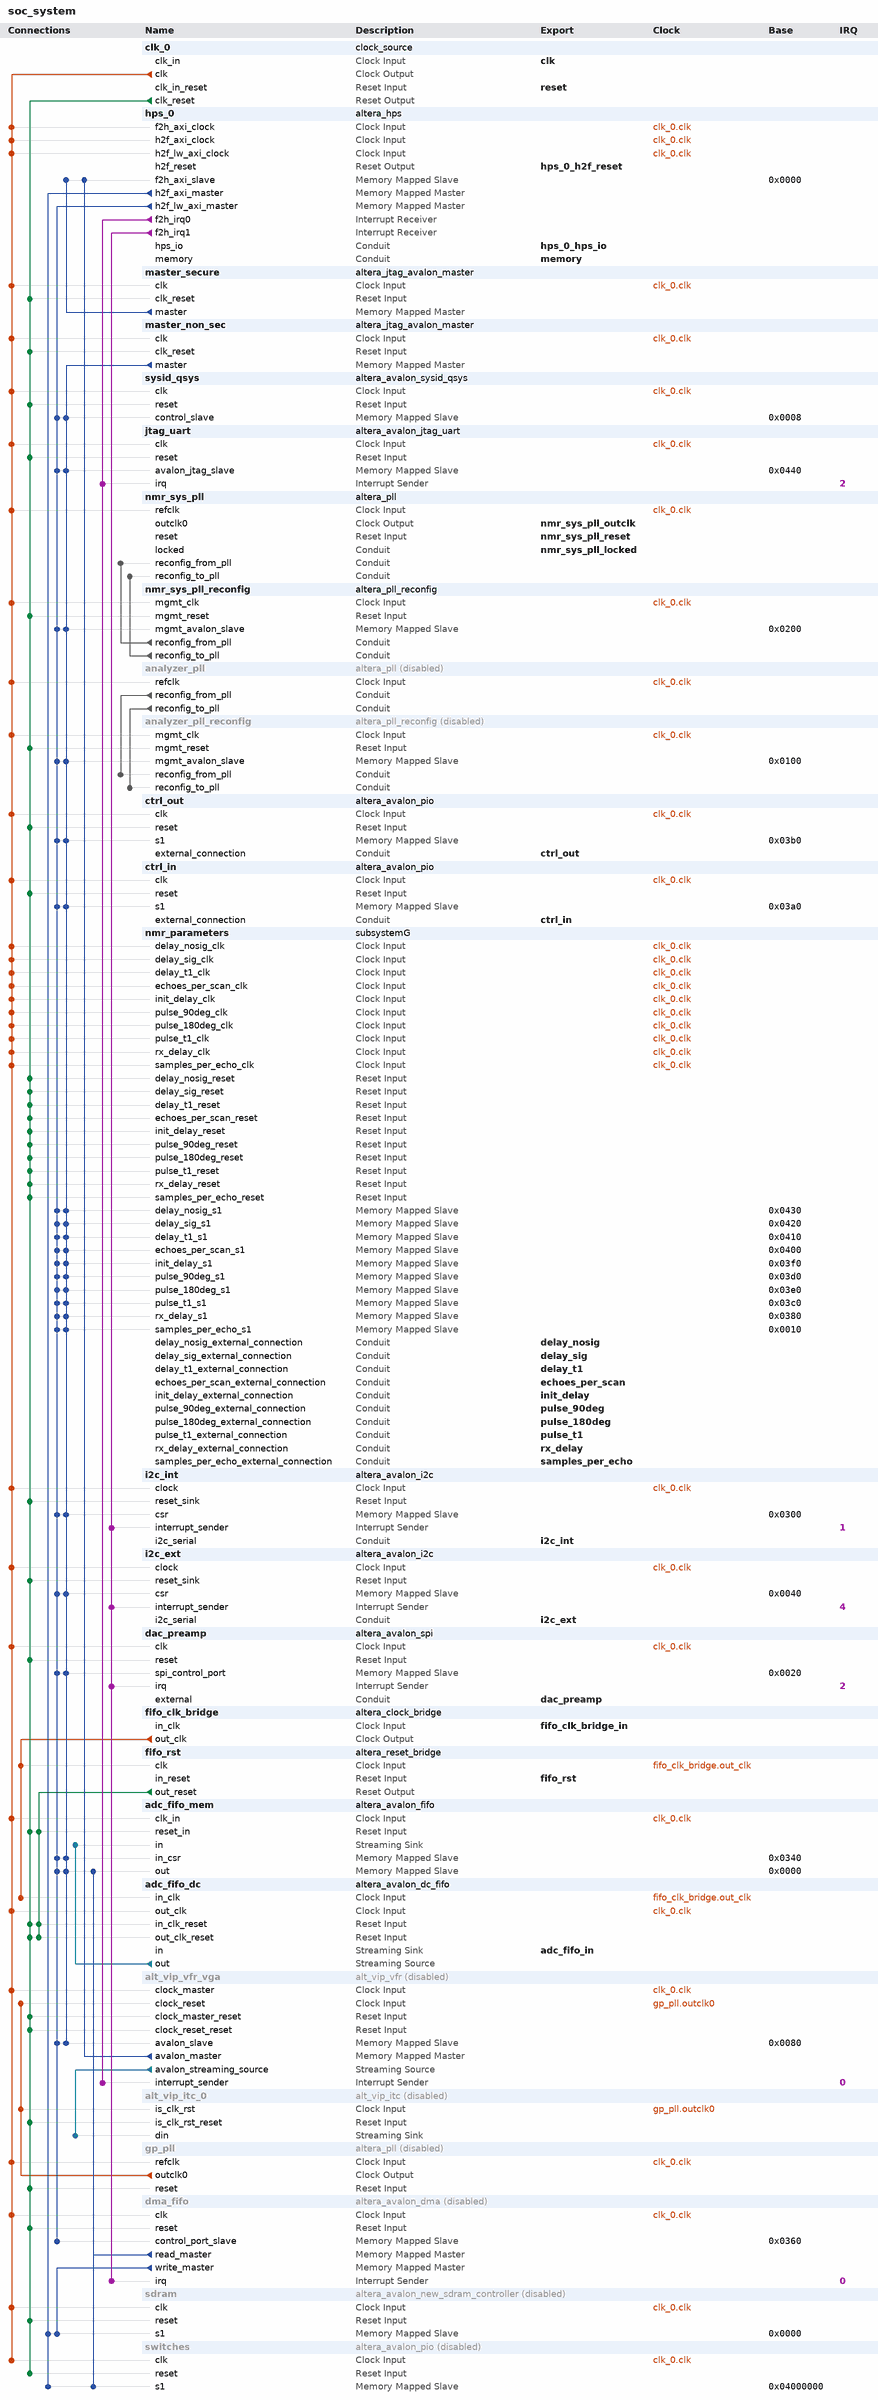
[diagram p0: system contents]
# Platform Designer (Qsys) system soc_system, Cyclone V 5CSEMA4U23C6
# Parameters at their usual value, and those the tool derives, are not listed.
package require -exact qsys 17.1
create_system soc_system
set_project_property DEVICE_FAMILY {Cyclone V}
set_project_property DEVICE 5CSEMA4U23C6

add_instance clk_0 clock_source 17.1
set_instance_parameter_value clk_0 clockFrequency 50000000

add_instance hps_0 altera_hps 17.1
set_instance_parameter_value hps_0 EMAC1_Mode RGMII
set_instance_parameter_value hps_0 EMAC1_PinMuxing {HPS I/O Set 0}
set_instance_parameter_value hps_0 F2SCLK_COLDRST_Enable false
set_instance_parameter_value hps_0 F2SCLK_DBGRST_Enable false
set_instance_parameter_value hps_0 F2SCLK_WARMRST_Enable false
set_instance_parameter_value hps_0 F2SINTERRUPT_Enable true
set_instance_parameter_value hps_0 F2S_Width 2
set_instance_parameter_value hps_0 FPGA_PERIPHERAL_OUTPUT_CLOCK_FREQ_EMAC0_GTX_CLK 100
set_instance_parameter_value hps_0 FPGA_PERIPHERAL_OUTPUT_CLOCK_FREQ_EMAC0_MD_CLK 100.0
set_instance_parameter_value hps_0 FPGA_PERIPHERAL_OUTPUT_CLOCK_FREQ_EMAC1_GTX_CLK 100
set_instance_parameter_value hps_0 FPGA_PERIPHERAL_OUTPUT_CLOCK_FREQ_EMAC1_MD_CLK 100.0
set_instance_parameter_value hps_0 HPS_PROTOCOL DDR3
set_instance_parameter_value hps_0 I2C0_Mode I2C
set_instance_parameter_value hps_0 I2C0_PinMuxing {HPS I/O Set 0}
set_instance_parameter_value hps_0 I2C1_Mode I2C
set_instance_parameter_value hps_0 I2C1_PinMuxing {HPS I/O Set 0}
set_instance_parameter_value hps_0 LWH2F_Enable true
set_instance_parameter_value hps_0 MEM_BANKADDR_WIDTH 3
set_instance_parameter_value hps_0 MEM_CLK_FREQ 400.0
set_instance_parameter_value hps_0 MEM_COL_ADDR_WIDTH 10
set_instance_parameter_value hps_0 MEM_DQ_WIDTH 32
set_instance_parameter_value hps_0 MEM_DRV_STR RZQ/6
set_instance_parameter_value hps_0 MEM_ROW_ADDR_WIDTH 15
set_instance_parameter_value hps_0 MEM_RTT_NOM RZQ/6
set_instance_parameter_value hps_0 MEM_RTT_WR {Dynamic ODT off}
set_instance_parameter_value hps_0 MEM_TCL 7
set_instance_parameter_value hps_0 MEM_TFAW_NS 37.5
set_instance_parameter_value hps_0 MEM_TRAS_NS 35.0
set_instance_parameter_value hps_0 MEM_TRCD_NS 13.75
set_instance_parameter_value hps_0 MEM_TRFC_NS 300.0
set_instance_parameter_value hps_0 MEM_TRP_NS 13.75
set_instance_parameter_value hps_0 MEM_VENDOR Other
set_instance_parameter_value hps_0 MEM_WTCL 7
set_instance_parameter_value hps_0 QSPI_Mode N/A
set_instance_parameter_value hps_0 QSPI_PinMuxing Unused
set_instance_parameter_value hps_0 REF_CLK_FREQ 25.0
set_instance_parameter_value hps_0 S2FCLK_USER2CLK 5
set_instance_parameter_value hps_0 S2F_Width 1
set_instance_parameter_value hps_0 SDIO_Mode {4-bit Data}
set_instance_parameter_value hps_0 SDIO_PinMuxing {HPS I/O Set 0}
set_instance_parameter_value hps_0 SPIM1_Mode {Single Slave Select}
set_instance_parameter_value hps_0 SPIM1_PinMuxing {HPS I/O Set 0}
set_instance_parameter_value hps_0 STM_Enable true
set_instance_parameter_value hps_0 TIMING_BOARD_AC_SKEW 0.02
set_instance_parameter_value hps_0 TIMING_BOARD_AC_TO_CK_SKEW 0.0
set_instance_parameter_value hps_0 TIMING_BOARD_DQ_TO_DQS_SKEW 0.0
set_instance_parameter_value hps_0 TIMING_BOARD_MAX_CK_DELAY 0.06
set_instance_parameter_value hps_0 TIMING_BOARD_MAX_DQS_DELAY 0.06
set_instance_parameter_value hps_0 TIMING_BOARD_SKEW_BETWEEN_DQS 0.02
set_instance_parameter_value hps_0 TIMING_BOARD_SKEW_CKDQS_DIMM_MAX 0.01
set_instance_parameter_value hps_0 TIMING_BOARD_SKEW_CKDQS_DIMM_MIN -0.01
set_instance_parameter_value hps_0 TIMING_BOARD_SKEW_WITHIN_DQS 0.02
set_instance_parameter_value hps_0 TIMING_TDH 125
set_instance_parameter_value hps_0 TIMING_TDQSCK 400
set_instance_parameter_value hps_0 TIMING_TDQSQ 120
set_instance_parameter_value hps_0 TIMING_TDS 50
set_instance_parameter_value hps_0 TIMING_TIH 250
set_instance_parameter_value hps_0 TIMING_TIS 175
set_instance_parameter_value hps_0 TIMING_TQSH 0.38
set_instance_parameter_value hps_0 UART0_Mode {No Flow Control}
set_instance_parameter_value hps_0 UART0_PinMuxing {HPS I/O Set 0}
set_instance_parameter_value hps_0 USB1_Mode SDR
set_instance_parameter_value hps_0 USB1_PinMuxing {HPS I/O Set 0}
set_instance_parameter_value hps_0 desired_cfg_clk_mhz 97.368421
set_instance_parameter_value hps_0 desired_qspi_clk_mhz 370.0

add_instance master_secure altera_jtag_avalon_master 17.1

add_instance master_non_sec altera_jtag_avalon_master 17.1

add_instance sysid_qsys altera_avalon_sysid_qsys 17.1
set_instance_parameter_value sysid_qsys id -1395322110

add_instance jtag_uart altera_avalon_jtag_uart 17.1
set_instance_parameter_value jtag_uart allowMultipleConnections true
set_instance_parameter_value jtag_uart simInteractiveOptions INTERACTIVE_ASCII_OUTPUT

add_instance nmr_sys_pll altera_pll 17.1
set_instance_parameter_value nmr_sys_pll gui_device_speed_grade 1
set_instance_parameter_value nmr_sys_pll gui_en_reconf true
set_instance_parameter_value nmr_sys_pll gui_number_of_clocks 1
set_instance_parameter_value nmr_sys_pll gui_operation_mode direct
set_instance_parameter_value nmr_sys_pll gui_output_clock_frequency0 120.0
set_instance_parameter_value nmr_sys_pll gui_pll_mode {Fractional-N PLL}
set_instance_parameter_value nmr_sys_pll gui_reference_clock_frequency 50.0
set_instance_parameter_value nmr_sys_pll gui_use_locked true

add_instance nmr_sys_pll_reconfig altera_pll_reconfig 17.1

add_instance analyzer_pll altera_pll 17.1
set_instance_property analyzer_pll ENABLED false
set_instance_parameter_value analyzer_pll gui_device_speed_grade 1
set_instance_parameter_value analyzer_pll gui_en_reconf true
set_instance_parameter_value analyzer_pll gui_number_of_clocks 4
set_instance_parameter_value analyzer_pll gui_operation_mode direct
set_instance_parameter_value analyzer_pll gui_output_clock_frequency0 4.3
set_instance_parameter_value analyzer_pll gui_output_clock_frequency1 4.3
set_instance_parameter_value analyzer_pll gui_output_clock_frequency2 4.3
set_instance_parameter_value analyzer_pll gui_output_clock_frequency3 4.3
set_instance_parameter_value analyzer_pll gui_pll_mode {Fractional-N PLL}
set_instance_parameter_value analyzer_pll gui_reference_clock_frequency 50.0
set_instance_parameter_value analyzer_pll gui_use_locked true

add_instance analyzer_pll_reconfig altera_pll_reconfig 17.1
set_instance_property analyzer_pll_reconfig ENABLED false

add_instance ctrl_out altera_avalon_pio 17.1
set_instance_parameter_value ctrl_out direction Output
set_instance_parameter_value ctrl_out resetValue 119
set_instance_parameter_value ctrl_out width 32

add_instance ctrl_in altera_avalon_pio 17.1
set_instance_parameter_value ctrl_in direction Input
set_instance_parameter_value ctrl_in width 8

add_instance nmr_parameters subsystemG 1.0

add_instance i2c_int altera_avalon_i2c 17.1
set_instance_parameter_value i2c_int FIFO_DEPTH 32

add_instance i2c_ext altera_avalon_i2c 17.1
set_instance_parameter_value i2c_ext FIFO_DEPTH 32

add_instance dac_preamp altera_avalon_spi 17.1
set_instance_parameter_value dac_preamp clockPolarity 1
set_instance_parameter_value dac_preamp dataWidth 24
set_instance_parameter_value dac_preamp masterSPI true
set_instance_parameter_value dac_preamp numberOfSlaves 1
set_instance_parameter_value dac_preamp targetClockRate 128000

add_instance fifo_clk_bridge altera_clock_bridge 17.1
set_instance_parameter_value fifo_clk_bridge DERIVED_CLOCK_RATE 0
set_instance_parameter_value fifo_clk_bridge EXPLICIT_CLOCK_RATE 0

add_instance fifo_rst altera_reset_bridge 17.1
set_instance_parameter_value fifo_rst ACTIVE_LOW_RESET 0
set_instance_parameter_value fifo_rst SYNCHRONOUS_EDGES deassert

add_instance adc_fifo_mem altera_avalon_fifo 17.1
set_instance_parameter_value adc_fifo_mem bitsPerSymbol 16
set_instance_parameter_value adc_fifo_mem channelWidth 0
set_instance_parameter_value adc_fifo_mem errorWidth 0
set_instance_parameter_value adc_fifo_mem fifoDepth 1024
set_instance_parameter_value adc_fifo_mem fifoInputInterfaceOptions AVALONST_SINK
set_instance_parameter_value adc_fifo_mem fifoOutputInterfaceOptions AVALONMM_READ
set_instance_parameter_value adc_fifo_mem singleClockMode true
set_instance_parameter_value adc_fifo_mem symbolsPerBeat 2
set_instance_parameter_value adc_fifo_mem useIRQ false
set_instance_parameter_value adc_fifo_mem usePacket false
set_instance_parameter_value adc_fifo_mem useReadControl false

add_instance adc_fifo_dc altera_avalon_dc_fifo 17.1
set_instance_parameter_value adc_fifo_dc BITS_PER_SYMBOL 16
set_instance_parameter_value adc_fifo_dc FIFO_DEPTH 65536
set_instance_parameter_value adc_fifo_dc USE_PACKETS 0

add_instance alt_vip_vfr_vga alt_vip_vfr 14.0
set_instance_property alt_vip_vfr_vga ENABLED false
set_instance_parameter_value alt_vip_vfr_vga MAX_IMAGE_WIDTH 1024

add_instance alt_vip_itc_0 alt_vip_itc 14.0
set_instance_property alt_vip_itc_0 ENABLED false
set_instance_parameter_value alt_vip_itc_0 FIFO_DEPTH 1920
set_instance_parameter_value alt_vip_itc_0 H_ACTIVE_PIXELS 1024
set_instance_parameter_value alt_vip_itc_0 H_BACK_PORCH 160
set_instance_parameter_value alt_vip_itc_0 H_FRONT_PORCH 24
set_instance_parameter_value alt_vip_itc_0 H_SYNC_LENGTH 136
set_instance_parameter_value alt_vip_itc_0 NUMBER_OF_COLOUR_PLANES 4
set_instance_parameter_value alt_vip_itc_0 THRESHOLD 1919
set_instance_parameter_value alt_vip_itc_0 V_ACTIVE_LINES 768
set_instance_parameter_value alt_vip_itc_0 V_BACK_PORCH 29
set_instance_parameter_value alt_vip_itc_0 V_FRONT_PORCH 3
set_instance_parameter_value alt_vip_itc_0 V_SYNC_LENGTH 6

add_instance gp_pll altera_pll 17.1
set_instance_property gp_pll ENABLED false
set_instance_parameter_value gp_pll gui_device_speed_grade 2
set_instance_parameter_value gp_pll gui_number_of_clocks 4
set_instance_parameter_value gp_pll gui_operation_mode normal
set_instance_parameter_value gp_pll gui_output_clock_frequency0 130.0
set_instance_parameter_value gp_pll gui_output_clock_frequency1 65.0
set_instance_parameter_value gp_pll gui_output_clock_frequency2 50.0
set_instance_parameter_value gp_pll gui_output_clock_frequency3 50.0
set_instance_parameter_value gp_pll gui_phase_shift3 -3800
set_instance_parameter_value gp_pll gui_pll_mode {Integer-N PLL}
set_instance_parameter_value gp_pll gui_reference_clock_frequency 50.0
set_instance_parameter_value gp_pll gui_use_locked true

add_instance dma_fifo altera_avalon_dma 17.1
set_instance_property dma_fifo ENABLED false
set_instance_parameter_value dma_fifo allowByteTransactions true
set_instance_parameter_value dma_fifo allowDoubleWordTransactions true
set_instance_parameter_value dma_fifo allowHalfWordTransactions true
set_instance_parameter_value dma_fifo allowQuadWordTransactions true
set_instance_parameter_value dma_fifo burstEnable false
set_instance_parameter_value dma_fifo fifoDepth 128
set_instance_parameter_value dma_fifo maxBurstSize 4
set_instance_parameter_value dma_fifo minimumDmaTransactionRegisterWidth 32

add_instance sdram altera_avalon_new_sdram_controller 17.1
set_instance_property sdram ENABLED false
set_instance_parameter_value sdram TAC 5.4
set_instance_parameter_value sdram TRCD 15.0
set_instance_parameter_value sdram TRP 15.0
set_instance_parameter_value sdram casLatency 3
set_instance_parameter_value sdram columnWidth 10
set_instance_parameter_value sdram dataWidth 16
set_instance_parameter_value sdram generateSimulationModel true
set_instance_parameter_value sdram model single_Micron_MT48LC4M32B2_7_chip
set_instance_parameter_value sdram numberOfBanks 4
set_instance_parameter_value sdram numberOfChipSelects 1
set_instance_parameter_value sdram powerUpDelay 100.0
set_instance_parameter_value sdram refreshPeriod 7.8125
set_instance_parameter_value sdram rowWidth 13

add_instance switches altera_avalon_pio 17.1
set_instance_property switches ENABLED false
set_instance_parameter_value switches direction Input
set_instance_parameter_value switches simDoTestBenchWiring true
set_instance_parameter_value switches width 10

# connections
add_connection clk_0.clk adc_fifo_dc.out_clk clock
add_connection clk_0.clk adc_fifo_mem.clk_in clock
add_connection clk_0.clk alt_vip_vfr_vga.clock_master clock
add_connection clk_0.clk analyzer_pll.refclk clock
add_connection clk_0.clk analyzer_pll_reconfig.mgmt_clk clock
add_connection clk_0.clk ctrl_in.clk clock
add_connection clk_0.clk ctrl_out.clk clock
add_connection clk_0.clk dac_preamp.clk clock
add_connection clk_0.clk dma_fifo.clk clock
add_connection clk_0.clk gp_pll.refclk clock
add_connection clk_0.clk hps_0.f2h_axi_clock clock
add_connection clk_0.clk hps_0.h2f_axi_clock clock
add_connection clk_0.clk hps_0.h2f_lw_axi_clock clock
add_connection clk_0.clk i2c_ext.clock clock
add_connection clk_0.clk i2c_int.clock clock
add_connection clk_0.clk jtag_uart.clk clock
add_connection clk_0.clk master_non_sec.clk clock
add_connection clk_0.clk master_secure.clk clock
add_connection clk_0.clk nmr_parameters.delay_nosig_clk clock
add_connection clk_0.clk nmr_parameters.delay_sig_clk clock
add_connection clk_0.clk nmr_parameters.delay_t1_clk clock
add_connection clk_0.clk nmr_parameters.echoes_per_scan_clk clock
add_connection clk_0.clk nmr_parameters.init_delay_clk clock
add_connection clk_0.clk nmr_parameters.pulse_90deg_clk clock
add_connection clk_0.clk nmr_parameters.pulse_180deg_clk clock
add_connection clk_0.clk nmr_parameters.pulse_t1_clk clock
add_connection clk_0.clk nmr_parameters.rx_delay_clk clock
add_connection clk_0.clk nmr_parameters.samples_per_echo_clk clock
add_connection clk_0.clk nmr_sys_pll.refclk clock
add_connection clk_0.clk nmr_sys_pll_reconfig.mgmt_clk clock
add_connection clk_0.clk sdram.clk clock
add_connection clk_0.clk switches.clk clock
add_connection clk_0.clk sysid_qsys.clk clock
add_connection fifo_clk_bridge.out_clk adc_fifo_dc.in_clk clock
add_connection fifo_clk_bridge.out_clk fifo_rst.clk clock
add_connection gp_pll.outclk0 alt_vip_itc_0.is_clk_rst clock
add_connection gp_pll.outclk0 alt_vip_vfr_vga.clock_reset clock
add_connection clk_0.clk_reset adc_fifo_dc.in_clk_reset reset
add_connection clk_0.clk_reset adc_fifo_dc.out_clk_reset reset
add_connection clk_0.clk_reset adc_fifo_mem.reset_in reset
add_connection clk_0.clk_reset alt_vip_itc_0.is_clk_rst_reset reset
add_connection clk_0.clk_reset alt_vip_vfr_vga.clock_master_reset reset
add_connection clk_0.clk_reset alt_vip_vfr_vga.clock_reset_reset reset
add_connection clk_0.clk_reset analyzer_pll_reconfig.mgmt_reset reset
add_connection clk_0.clk_reset ctrl_in.reset reset
add_connection clk_0.clk_reset ctrl_out.reset reset
add_connection clk_0.clk_reset dac_preamp.reset reset
add_connection clk_0.clk_reset dma_fifo.reset reset
add_connection clk_0.clk_reset gp_pll.reset reset
add_connection clk_0.clk_reset i2c_ext.reset_sink reset
add_connection clk_0.clk_reset i2c_int.reset_sink reset
add_connection clk_0.clk_reset jtag_uart.reset reset
add_connection clk_0.clk_reset master_non_sec.clk_reset reset
add_connection clk_0.clk_reset master_secure.clk_reset reset
add_connection clk_0.clk_reset nmr_parameters.delay_nosig_reset reset
add_connection clk_0.clk_reset nmr_parameters.delay_sig_reset reset
add_connection clk_0.clk_reset nmr_parameters.delay_t1_reset reset
add_connection clk_0.clk_reset nmr_parameters.echoes_per_scan_reset reset
add_connection clk_0.clk_reset nmr_parameters.init_delay_reset reset
add_connection clk_0.clk_reset nmr_parameters.pulse_90deg_reset reset
add_connection clk_0.clk_reset nmr_parameters.pulse_180deg_reset reset
add_connection clk_0.clk_reset nmr_parameters.pulse_t1_reset reset
add_connection clk_0.clk_reset nmr_parameters.rx_delay_reset reset
add_connection clk_0.clk_reset nmr_parameters.samples_per_echo_reset reset
add_connection clk_0.clk_reset nmr_sys_pll_reconfig.mgmt_reset reset
add_connection clk_0.clk_reset sdram.reset reset
add_connection clk_0.clk_reset switches.reset reset
add_connection clk_0.clk_reset sysid_qsys.reset reset
add_connection fifo_rst.out_reset adc_fifo_dc.in_clk_reset reset
add_connection fifo_rst.out_reset adc_fifo_dc.out_clk_reset reset
add_connection fifo_rst.out_reset adc_fifo_mem.reset_in reset
add_connection alt_vip_vfr_vga.avalon_master hps_0.f2h_axi_slave avalon
set_connection_parameter_value alt_vip_vfr_vga.avalon_master/hps_0.f2h_axi_slave baseAddress 0x0000
add_connection dma_fifo.read_master adc_fifo_mem.out avalon
set_connection_parameter_value dma_fifo.read_master/adc_fifo_mem.out baseAddress 0x0000
add_connection dma_fifo.read_master switches.s1 avalon
set_connection_parameter_value dma_fifo.read_master/switches.s1 baseAddress 0x04000000
add_connection dma_fifo.write_master sdram.s1 avalon
set_connection_parameter_value dma_fifo.write_master/sdram.s1 baseAddress 0x0000
add_connection hps_0.h2f_axi_master sdram.s1 avalon
set_connection_parameter_value hps_0.h2f_axi_master/sdram.s1 baseAddress 0x0000
add_connection hps_0.h2f_axi_master switches.s1 avalon
set_connection_parameter_value hps_0.h2f_axi_master/switches.s1 baseAddress 0x04000000
add_connection hps_0.h2f_lw_axi_master adc_fifo_mem.in_csr avalon
set_connection_parameter_value hps_0.h2f_lw_axi_master/adc_fifo_mem.in_csr baseAddress 0x0340
add_connection hps_0.h2f_lw_axi_master adc_fifo_mem.out avalon
set_connection_parameter_value hps_0.h2f_lw_axi_master/adc_fifo_mem.out baseAddress 0x0000
add_connection hps_0.h2f_lw_axi_master alt_vip_vfr_vga.avalon_slave avalon
set_connection_parameter_value hps_0.h2f_lw_axi_master/alt_vip_vfr_vga.avalon_slave baseAddress 0x0080
add_connection hps_0.h2f_lw_axi_master analyzer_pll_reconfig.mgmt_avalon_slave avalon
set_connection_parameter_value hps_0.h2f_lw_axi_master/analyzer_pll_reconfig.mgmt_avalon_slave baseAddress 0x0100
add_connection hps_0.h2f_lw_axi_master ctrl_in.s1 avalon
set_connection_parameter_value hps_0.h2f_lw_axi_master/ctrl_in.s1 baseAddress 0x03a0
add_connection hps_0.h2f_lw_axi_master ctrl_out.s1 avalon
set_connection_parameter_value hps_0.h2f_lw_axi_master/ctrl_out.s1 baseAddress 0x03b0
add_connection hps_0.h2f_lw_axi_master dac_preamp.spi_control_port avalon
set_connection_parameter_value hps_0.h2f_lw_axi_master/dac_preamp.spi_control_port baseAddress 0x0020
add_connection hps_0.h2f_lw_axi_master dma_fifo.control_port_slave avalon
set_connection_parameter_value hps_0.h2f_lw_axi_master/dma_fifo.control_port_slave baseAddress 0x0360
add_connection hps_0.h2f_lw_axi_master i2c_ext.csr avalon
set_connection_parameter_value hps_0.h2f_lw_axi_master/i2c_ext.csr baseAddress 0x0040
add_connection hps_0.h2f_lw_axi_master i2c_int.csr avalon
set_connection_parameter_value hps_0.h2f_lw_axi_master/i2c_int.csr baseAddress 0x0300
add_connection hps_0.h2f_lw_axi_master jtag_uart.avalon_jtag_slave avalon
set_connection_parameter_value hps_0.h2f_lw_axi_master/jtag_uart.avalon_jtag_slave baseAddress 0x0440
add_connection hps_0.h2f_lw_axi_master nmr_parameters.delay_nosig_s1 avalon
set_connection_parameter_value hps_0.h2f_lw_axi_master/nmr_parameters.delay_nosig_s1 baseAddress 0x0430
add_connection hps_0.h2f_lw_axi_master nmr_parameters.delay_sig_s1 avalon
set_connection_parameter_value hps_0.h2f_lw_axi_master/nmr_parameters.delay_sig_s1 baseAddress 0x0420
add_connection hps_0.h2f_lw_axi_master nmr_parameters.delay_t1_s1 avalon
set_connection_parameter_value hps_0.h2f_lw_axi_master/nmr_parameters.delay_t1_s1 baseAddress 0x0410
add_connection hps_0.h2f_lw_axi_master nmr_parameters.echoes_per_scan_s1 avalon
set_connection_parameter_value hps_0.h2f_lw_axi_master/nmr_parameters.echoes_per_scan_s1 baseAddress 0x0400
add_connection hps_0.h2f_lw_axi_master nmr_parameters.init_delay_s1 avalon
set_connection_parameter_value hps_0.h2f_lw_axi_master/nmr_parameters.init_delay_s1 baseAddress 0x03f0
add_connection hps_0.h2f_lw_axi_master nmr_parameters.pulse_90deg_s1 avalon
set_connection_parameter_value hps_0.h2f_lw_axi_master/nmr_parameters.pulse_90deg_s1 baseAddress 0x03d0
add_connection hps_0.h2f_lw_axi_master nmr_parameters.pulse_180deg_s1 avalon
set_connection_parameter_value hps_0.h2f_lw_axi_master/nmr_parameters.pulse_180deg_s1 baseAddress 0x03e0
add_connection hps_0.h2f_lw_axi_master nmr_parameters.pulse_t1_s1 avalon
set_connection_parameter_value hps_0.h2f_lw_axi_master/nmr_parameters.pulse_t1_s1 baseAddress 0x03c0
add_connection hps_0.h2f_lw_axi_master nmr_parameters.rx_delay_s1 avalon
set_connection_parameter_value hps_0.h2f_lw_axi_master/nmr_parameters.rx_delay_s1 baseAddress 0x0380
add_connection hps_0.h2f_lw_axi_master nmr_parameters.samples_per_echo_s1 avalon
set_connection_parameter_value hps_0.h2f_lw_axi_master/nmr_parameters.samples_per_echo_s1 baseAddress 0x0010
add_connection hps_0.h2f_lw_axi_master nmr_sys_pll_reconfig.mgmt_avalon_slave avalon
set_connection_parameter_value hps_0.h2f_lw_axi_master/nmr_sys_pll_reconfig.mgmt_avalon_slave baseAddress 0x0200
add_connection hps_0.h2f_lw_axi_master sysid_qsys.control_slave avalon
set_connection_parameter_value hps_0.h2f_lw_axi_master/sysid_qsys.control_slave baseAddress 0x0008
add_connection master_non_sec.master adc_fifo_mem.in_csr avalon
set_connection_parameter_value master_non_sec.master/adc_fifo_mem.in_csr baseAddress 0x0340
add_connection master_non_sec.master adc_fifo_mem.out avalon
set_connection_parameter_value master_non_sec.master/adc_fifo_mem.out baseAddress 0x0000
add_connection master_non_sec.master alt_vip_vfr_vga.avalon_slave avalon
set_connection_parameter_value master_non_sec.master/alt_vip_vfr_vga.avalon_slave baseAddress 0x0080
add_connection master_non_sec.master analyzer_pll_reconfig.mgmt_avalon_slave avalon
set_connection_parameter_value master_non_sec.master/analyzer_pll_reconfig.mgmt_avalon_slave baseAddress 0x0100
add_connection master_non_sec.master ctrl_in.s1 avalon
set_connection_parameter_value master_non_sec.master/ctrl_in.s1 baseAddress 0x03a0
add_connection master_non_sec.master ctrl_out.s1 avalon
set_connection_parameter_value master_non_sec.master/ctrl_out.s1 baseAddress 0x03b0
add_connection master_non_sec.master dac_preamp.spi_control_port avalon
set_connection_parameter_value master_non_sec.master/dac_preamp.spi_control_port baseAddress 0x0020
add_connection master_non_sec.master i2c_ext.csr avalon
set_connection_parameter_value master_non_sec.master/i2c_ext.csr baseAddress 0x0040
add_connection master_non_sec.master i2c_int.csr avalon
set_connection_parameter_value master_non_sec.master/i2c_int.csr baseAddress 0x0300
add_connection master_non_sec.master jtag_uart.avalon_jtag_slave avalon
set_connection_parameter_value master_non_sec.master/jtag_uart.avalon_jtag_slave baseAddress 0x0440
add_connection master_non_sec.master nmr_parameters.delay_nosig_s1 avalon
set_connection_parameter_value master_non_sec.master/nmr_parameters.delay_nosig_s1 baseAddress 0x0430
add_connection master_non_sec.master nmr_parameters.delay_sig_s1 avalon
set_connection_parameter_value master_non_sec.master/nmr_parameters.delay_sig_s1 baseAddress 0x0420
add_connection master_non_sec.master nmr_parameters.delay_t1_s1 avalon
set_connection_parameter_value master_non_sec.master/nmr_parameters.delay_t1_s1 baseAddress 0x0410
add_connection master_non_sec.master nmr_parameters.echoes_per_scan_s1 avalon
set_connection_parameter_value master_non_sec.master/nmr_parameters.echoes_per_scan_s1 baseAddress 0x0400
add_connection master_non_sec.master nmr_parameters.init_delay_s1 avalon
set_connection_parameter_value master_non_sec.master/nmr_parameters.init_delay_s1 baseAddress 0x03f0
add_connection master_non_sec.master nmr_parameters.pulse_90deg_s1 avalon
set_connection_parameter_value master_non_sec.master/nmr_parameters.pulse_90deg_s1 baseAddress 0x03d0
add_connection master_non_sec.master nmr_parameters.pulse_180deg_s1 avalon
set_connection_parameter_value master_non_sec.master/nmr_parameters.pulse_180deg_s1 baseAddress 0x03e0
add_connection master_non_sec.master nmr_parameters.pulse_t1_s1 avalon
set_connection_parameter_value master_non_sec.master/nmr_parameters.pulse_t1_s1 baseAddress 0x03c0
add_connection master_non_sec.master nmr_parameters.rx_delay_s1 avalon
set_connection_parameter_value master_non_sec.master/nmr_parameters.rx_delay_s1 baseAddress 0x0380
add_connection master_non_sec.master nmr_parameters.samples_per_echo_s1 avalon
set_connection_parameter_value master_non_sec.master/nmr_parameters.samples_per_echo_s1 baseAddress 0x0010
add_connection master_non_sec.master nmr_sys_pll_reconfig.mgmt_avalon_slave avalon
set_connection_parameter_value master_non_sec.master/nmr_sys_pll_reconfig.mgmt_avalon_slave baseAddress 0x0200
add_connection master_non_sec.master sysid_qsys.control_slave avalon
set_connection_parameter_value master_non_sec.master/sysid_qsys.control_slave baseAddress 0x0008
add_connection master_secure.master hps_0.f2h_axi_slave avalon
set_connection_parameter_value master_secure.master/hps_0.f2h_axi_slave baseAddress 0x0000
add_connection adc_fifo_dc.out adc_fifo_mem.in avalon_streaming
add_connection alt_vip_vfr_vga.avalon_streaming_source alt_vip_itc_0.din avalon_streaming
add_connection analyzer_pll.reconfig_from_pll analyzer_pll_reconfig.reconfig_from_pll conduit
add_connection analyzer_pll.reconfig_to_pll analyzer_pll_reconfig.reconfig_to_pll conduit
add_connection nmr_sys_pll_reconfig.reconfig_from_pll nmr_sys_pll.reconfig_from_pll conduit
add_connection nmr_sys_pll_reconfig.reconfig_to_pll nmr_sys_pll.reconfig_to_pll conduit
add_connection hps_0.f2h_irq0 alt_vip_vfr_vga.interrupt_sender interrupt
set_connection_parameter_value hps_0.f2h_irq0/alt_vip_vfr_vga.interrupt_sender irqNumber 0
add_connection hps_0.f2h_irq0 jtag_uart.irq interrupt
set_connection_parameter_value hps_0.f2h_irq0/jtag_uart.irq irqNumber 2
add_connection hps_0.f2h_irq1 dac_preamp.irq interrupt
set_connection_parameter_value hps_0.f2h_irq1/dac_preamp.irq irqNumber 2
add_connection hps_0.f2h_irq1 dma_fifo.irq interrupt
set_connection_parameter_value hps_0.f2h_irq1/dma_fifo.irq irqNumber 0
add_connection hps_0.f2h_irq1 i2c_ext.interrupt_sender interrupt
set_connection_parameter_value hps_0.f2h_irq1/i2c_ext.interrupt_sender irqNumber 4
add_connection hps_0.f2h_irq1 i2c_int.interrupt_sender interrupt
set_connection_parameter_value hps_0.f2h_irq1/i2c_int.interrupt_sender irqNumber 1

# exported interfaces
add_interface adc_fifo_in avalon_streaming sink
set_interface_property adc_fifo_in EXPORT_OF adc_fifo_dc.in
add_interface clk clock sink
set_interface_property clk EXPORT_OF clk_0.clk_in
add_interface ctrl_in conduit end
set_interface_property ctrl_in EXPORT_OF ctrl_in.external_connection
add_interface ctrl_out conduit end
set_interface_property ctrl_out EXPORT_OF ctrl_out.external_connection
add_interface dac_preamp conduit end
set_interface_property dac_preamp EXPORT_OF dac_preamp.external
add_interface delay_nosig conduit end
set_interface_property delay_nosig EXPORT_OF nmr_parameters.delay_nosig_external_connection
add_interface delay_sig conduit end
set_interface_property delay_sig EXPORT_OF nmr_parameters.delay_sig_external_connection
add_interface delay_t1 conduit end
set_interface_property delay_t1 EXPORT_OF nmr_parameters.delay_t1_external_connection
add_interface echoes_per_scan conduit end
set_interface_property echoes_per_scan EXPORT_OF nmr_parameters.echoes_per_scan_external_connection
add_interface fifo_clk_bridge_in clock sink
set_interface_property fifo_clk_bridge_in EXPORT_OF fifo_clk_bridge.in_clk
add_interface fifo_rst reset sink
set_interface_property fifo_rst EXPORT_OF fifo_rst.in_reset
add_interface hps_0_h2f_reset reset source
set_interface_property hps_0_h2f_reset EXPORT_OF hps_0.h2f_reset
add_interface hps_0_hps_io conduit end
set_interface_property hps_0_hps_io EXPORT_OF hps_0.hps_io
add_interface i2c_ext conduit end
set_interface_property i2c_ext EXPORT_OF i2c_ext.i2c_serial
add_interface i2c_int conduit end
set_interface_property i2c_int EXPORT_OF i2c_int.i2c_serial
add_interface init_delay conduit end
set_interface_property init_delay EXPORT_OF nmr_parameters.init_delay_external_connection
add_interface memory conduit end
set_interface_property memory EXPORT_OF hps_0.memory
add_interface nmr_sys_pll_locked conduit end
set_interface_property nmr_sys_pll_locked EXPORT_OF nmr_sys_pll.locked
add_interface nmr_sys_pll_outclk clock source
set_interface_property nmr_sys_pll_outclk EXPORT_OF nmr_sys_pll.outclk0
add_interface nmr_sys_pll_reset reset sink
set_interface_property nmr_sys_pll_reset EXPORT_OF nmr_sys_pll.reset
add_interface pulse_180deg conduit end
set_interface_property pulse_180deg EXPORT_OF nmr_parameters.pulse_180deg_external_connection
add_interface pulse_90deg conduit end
set_interface_property pulse_90deg EXPORT_OF nmr_parameters.pulse_90deg_external_connection
add_interface pulse_t1 conduit end
set_interface_property pulse_t1 EXPORT_OF nmr_parameters.pulse_t1_external_connection
add_interface reset reset sink
set_interface_property reset EXPORT_OF clk_0.clk_in_reset
add_interface rx_delay conduit end
set_interface_property rx_delay EXPORT_OF nmr_parameters.rx_delay_external_connection
add_interface samples_per_echo conduit end
set_interface_property samples_per_echo EXPORT_OF nmr_parameters.samples_per_echo_external_connection

set_interconnect_requirement {$system} qsys_mm.clockCrossingAdapter HANDSHAKE
set_interconnect_requirement {$system} qsys_mm.maxAdditionalLatency 1

save_system soc_system.qsys
